# EAGLE design untitled (EAGLE 7.2.0)
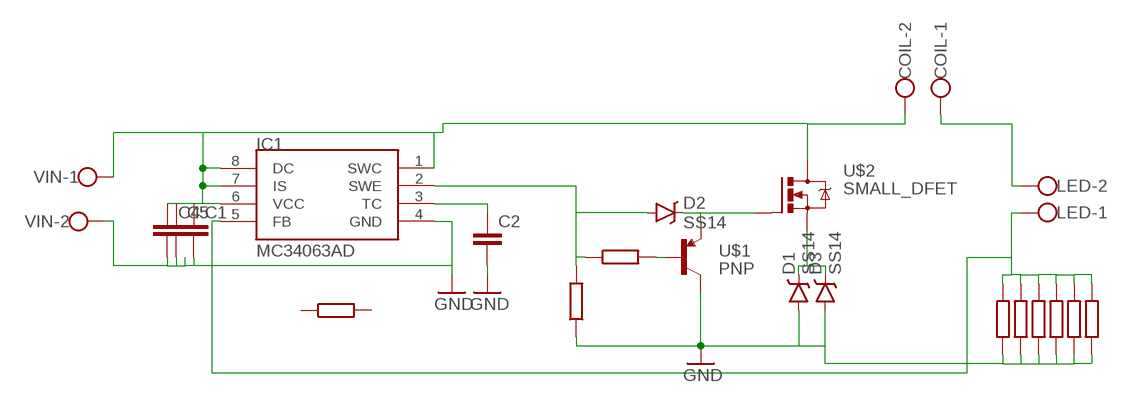
[diagram p0: schematic, sheet 1]

## Parts
C1  CC0805  [C0805]
C2  CC0603  [C0603]
C4  CC0805  [C0805]
C5  CC0805  [C0805]
COIL  W237-102  [W237-102]
D1  SS14  [SMA-DIODE]
D2  SS14  [SMA-DIODE]
D3  SS14  [SMA-DIODE]
IC1  MC34063AD  [SOIC8]
LED  W237-102  [W237-102]
R1  R1206  [R1206]
R3  R0805  [R0805]
R4  R0805  [R0805]
R5  R0805  [R0805]
R6  R0805  [R0805]
R7  R0805  [R0805]
R8  R0805  [R0805]
R9  R0805  [R0805]
R10  R0805  [R0805]
U$1  PNP  [SOT23]
U$2  SMALL_DFET  [SMALL_DIRFET]
VIN  W237-102  [W237-102]

## Nets
GND: C1.2 C2.2 C4.2 C5.2 D1.A D3.A IC1.4(GND) R4.1 R5.1 R6.1 R7.1 R8.1 R9.1 R10.1 U$1.3(C) VIN.2
N$1: C1.1 C4.1 C5.1 COIL.2 IC1.1(SWC) IC1.6(VCC) IC1.7(IS) IC1.8(DC) U$2.D U$2.D`(D) VIN.1
N$2: C2.1 IC1.3(TC)
N$4: D2.C U$1.2(E) U$2.G
N$6: R3.2 U$1.1(B)
N$7: D2.A IC1.2(SWE) R3.1 R4.2
N$11: D1.C D3.C U$2.S
N$12: COIL.1 LED.2
N$13: IC1.5(FB) LED.1 R5.2 R6.2 R7.2 R8.2 R9.2 R10.2
Unconnected: R1.1 R1.2

## Library data of the parts
C1 C2 C4 C5 = CasaLibrary:C: Capacitor
COIL LED VIN = con-wago-500:W237-102: WAGO SCREW CLAMP; MPN: 237-102; OC_FARNELL: unknown; OC_NEWARK: 70K9898
D1-D3 = CasaLibrary:SS14
IC1 = CasaLibrary:MC34063
R1 R3-R10 = CasaLibrary:R
U$1 = CasaLibrary:PNP
U$2 = CasaLibrary:SMALL_DFET

## Board
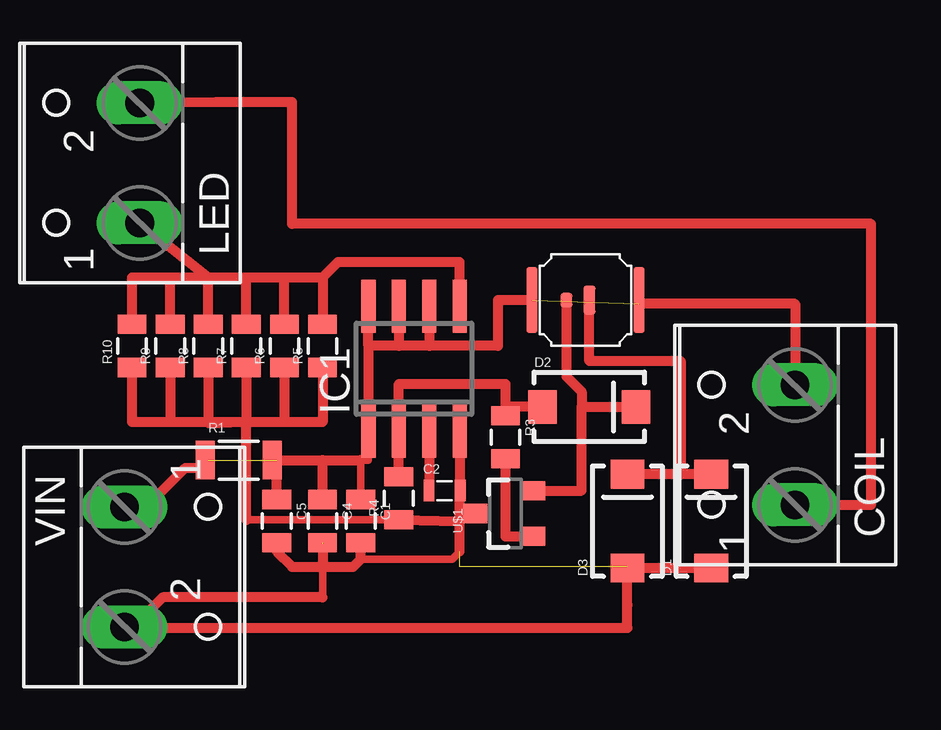
[diagram p1: board, top side]

No outline drawn. Coordinates in mm, seen from the top.
Copper layers (1*16): Top 0.035mm / dielectric 1.5mm / Bottom 0.035mm
Design rules "default *": minimum track width 0.2mm, minimum drill 0.2mm, track to track 0.2mm, track to pad 0.2mm, pad to pad 0.2mm, via to via 0.2mm, smd to smd 0.2mm, copper to edge 0.2mm, drill to drill 0.2mm, minimum pad ring 10mil, minimum via ring 8mil, stop-mask expansion 0mil, vias tented up to drill 0mil, thermal gap 10mil

### Footprints (pad centres in the part's own frame; a part is rotated, then mirrored left to right if it is on the bottom)
C0805 = smd 0.8 x 1.2: 1 -0.9,0; 2 0.9,0
C0603 = smd 0.45 x 0.9: 1 -0.65,0; 2 0.65,0
W237-102 = drill 1.194 long: 1 -2.5,-1.27; 2 2.5,-1.27
SMA-DIODE = smd 1.2 x 1.4: A -1.95,0; C 1.95,0
SOIC8 = smd 0.6 x 2.2: 1 -1.905,-2.6; 2 -0.635,-2.6; 3 0.635,-2.6; 4 1.905,-2.6; 5 1.905,2.6; 6 0.635,2.6; 7 -0.635,2.6; 8 -1.905,2.6
R1206 = smd 0.8 x 1.6: 1 -1.4,0; 2 1.4,0
R0805 = smd 0.8 x 1.2: 1 -0.9,0; 2 0.9,0
SOT23 = smd 0.8 x 1: 1 -0.95,-1.159; 2 0.95,-1.159; 3 0,1.259
SMALL_DIRFET = smd 0.45 x 2.75: D 2.064,0.635; D` -2.381,0.635 | smd 0.5 x 0.6: G -0.953,0.635 | smd 0.5 x 1.2: S 0,0.635

### Placement (x,y rotation side)
C1  11.11,29.21 270 top
C2  14.61,30.48 0 top
C4  9.53,29.21 270 top
C5  7.62,29.21 270 top
COIL  27.94,32.38 90 top
D1  25.72,29.21 90 top
D2  20.64,33.97 0 top
D3  22.23,29.21 90 top
IC1  13.34,35.56 0 top
LED  0.64,44.13 90 top
R1  6.03,31.75 0 top
R3  17.14,32.7 270 top
R4  12.7,30.16 90 top
R5  9.53,36.51 90 top
R6  7.94,36.51 90 top
R7  6.35,36.51 90 top
R8  4.76,36.51 90 top
R9  3.17,36.51 90 top
R10  1.59,36.51 90 top
U$1  17.14,29.53 90 top
U$2  20.64,37.78 0 top
VIN  2.54,27.3 270 top

### Tracks (layer width: path | path; a pad name or v marks a point on that pad's centre or on a via)
GND  (3 unrouted)
  Top 0.305: 11.11,27.62 14.92,27.62 15.24,27.94 | 9.53,26.04 9.53,27.3 | 11.06,28.26 C1.2 | R4.1 6.35,29.26
  Top 0.406: 15.24,32.38 IC1.4 15.24,32.69 | 15.24,32.38 15.24,30.48 | 15.24,30.5 C2.2 15.24,30.48 | R4.1 15.24,29.21 | 4.76,33.3 5.71,33.34 | 5.71,33.34 4.76,33.34 | 4.76,33.34 3.17,33.34 | 3.17,33.34 1.59,33.34 R10.1 | R9.1 3.17,33.34 | R8.1 4.76,33.34 | R7.1 6.35,33.34 | 6.35,33.34 5.71,33.34 | R6.1 7.94,33.34 | 7.94,33.34 6.35,33.34 | R5.1 9.53,33.34 7.94,33.34 | D3.A D1.A | D3.A 22.23,27.3 | 15.24,27.94 15.24,29.21 | 15.24,29.21 15.24,29.53 | 15.24,29.53 15.24,30.48 | 15.25,32.37 15.24,32.38 | U$1.3 15.24,29.53 | VIN.2 1.27,24.77 1.59,24.77 | 22.23,25.72 D3.A | 1.59,24.77 22.23,24.77 D3.A | 9.53,26.04 2.86,26.04 1.59,24.77 | 6.35,29.26 6.35,33.34 | C5.2 7.62,27.94 8.26,27.3 9.53,27.3 | 9.53,28.26 9.53,27.3 | 9.53,27.3 10.79,27.3 11.11,27.62 C1.2
N$1  (2 unrouted)
  Top 0.305: C1.1 11.11,31.75 11.43,31.75 IC1.1
  Top 0.406: COIL.2 29.21,38.26 22.7,38.26 U$2.D | U$2.D` 16.83,38.42 16.83,36.51 13.97,36.51 | 13.97,36.51 12.7,36.51 | 12.7,36.51 11.43,36.51 | 11.43,36.51 IC1.8 | IC1.7 12.7,36.51 | IC1.6 13.97,36.51 | 11.43,36.51 IC1.1 | -0.32,29.8 VIN.1 2.18,29.8 3.81,31.43 4.45,31.43 4.76,31.75 | C5.1 7.62,31.75 9.53,31.75 | C4.1 9.53,31.75 | 9.53,31.75 11.11,31.75
N$2
  Top 0.406: IC1.3 13.97,30.5 C2.1
N$4
  Top 0.406: U$1.2 20.32,30.48 20.32,33.97 | 20.32,33.97 D2.C | 20.32,33.97 20.32,34.61 19.68,35.24 U$2.G
N$6
  Top 0.406: R3.2 17.14,28.58 U$1.1
N$7
  Top 0.406: D2.A 17.14,33.97 R3.1 17.14,34.92 12.7,34.92 IC1.2 R4.2
N$11
  Top 0.406: D1.C 24.45,31.16 | 24.45,31.16 D3.C | 24.45,31.16 24.45,35.88 20.64,35.88 U$2.S
N$12
  Top 0.406: COIL.1 32.38,29.89 32.38,41.59 8.26,41.59 8.26,46.67 5.08,46.67 LED.2
N$13
  Top 0.406: R10.2 1.59,39.37 3.17,39.37 | 3.17,39.37 4.76,39.37 | 4.76,39.37 6.35,39.37 | 6.35,39.37 7.94,39.37 | 7.94,39.37 9.53,39.37 | 9.53,39.37 R5.2 | R6.2 7.94,39.37 | R7.2 6.35,39.37 | R8.2 4.76,39.37 | R9.2 3.17,39.37 | LED.1 4.76,39.37 | IC1.5 15.24,40.01 10.16,40.01 9.53,39.37